# EasyEDA Pro project LIN Interceptor Board EasyEDA Pro.epro

# Schematic LIN Custom Board Final
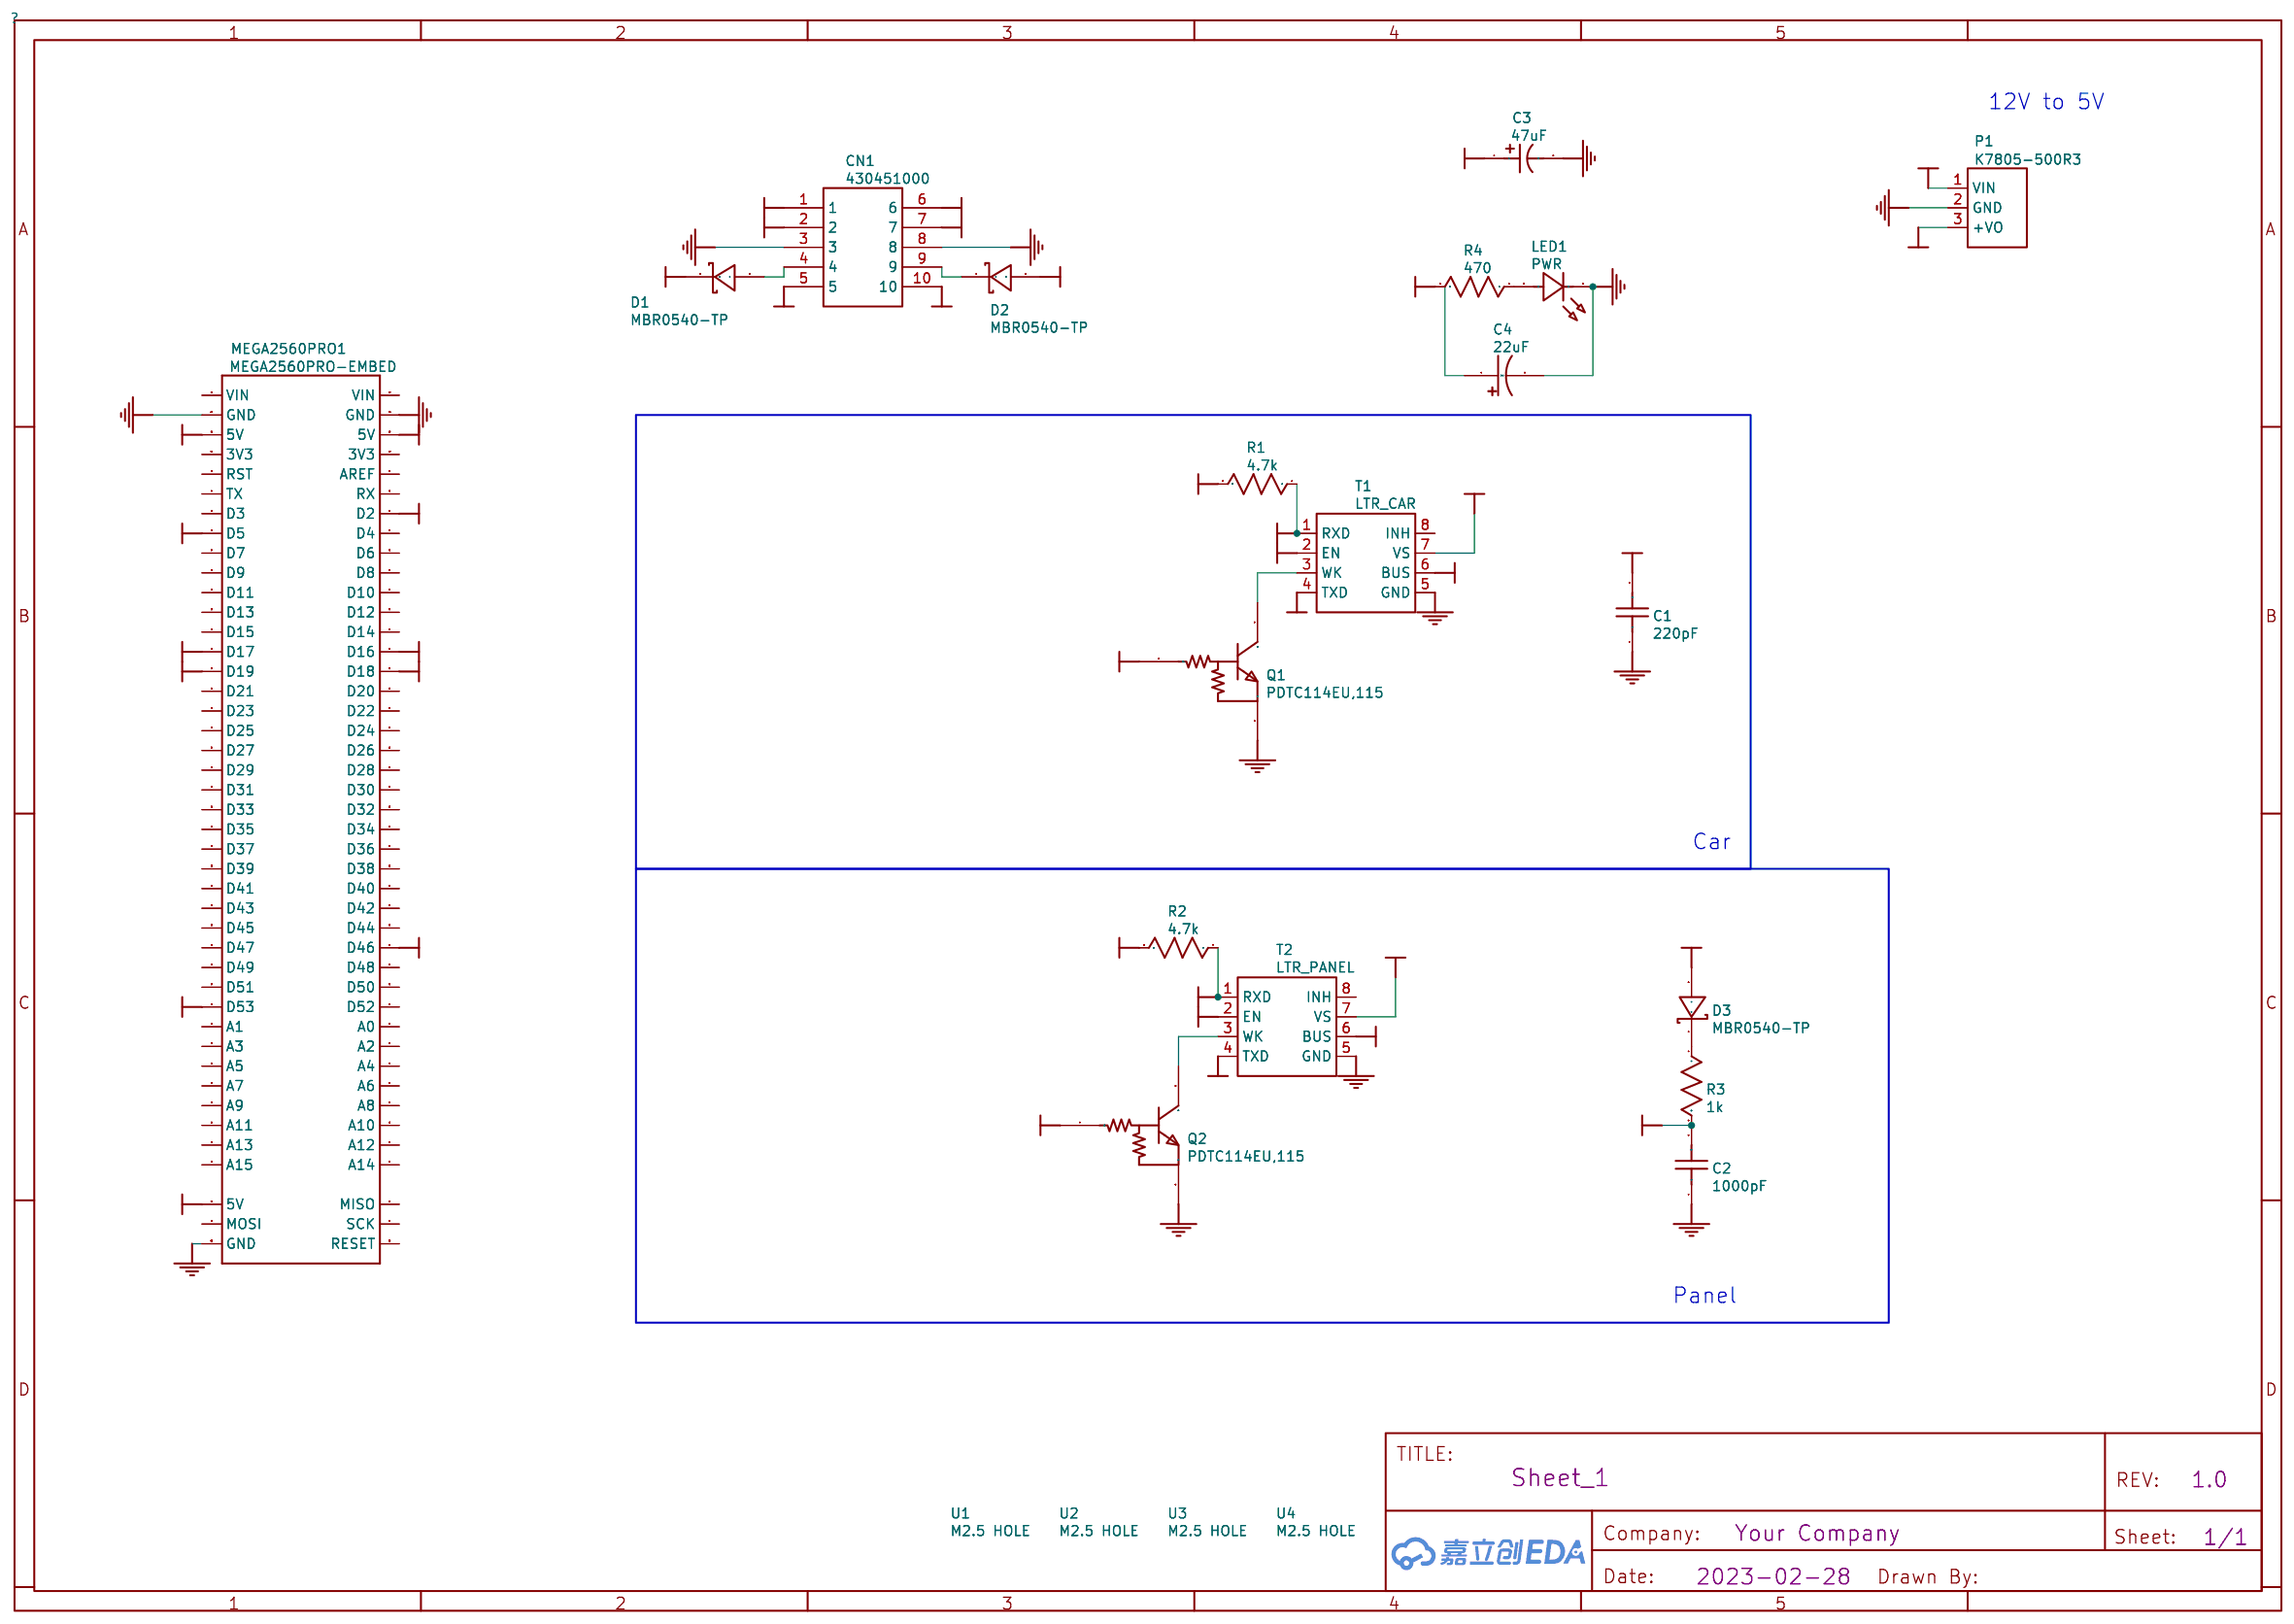
[diagram p0: schematic sheet]

## Parts
C1  220pF  [C0603]
C2  1000pF  [C0603]
C3  47uF  [CAP-SMD_BD6.3-L6.6-W6.6-LS7.3-FD]
C4  22uF  [CAP-SMD_BD4.0-L4.3-W4.3-LS5.3-FD]
CN1  430451000  [CONN-TH_43045-1000]
D1  MBR0540-TP  [SOD-123_L2.7-W1.6-LS3.7-RD]
D2  MBR0540-TP  [SOD-123_L2.7-W1.6-LS3.7-RD]
D3  MBR0540-TP  [SOD-123_L2.7-W1.6-LS3.7-RD]
LED1  PWR  [LED0603-RD_RED]
MEGA2560PRO1  MEGA2560PRO-EMBED  [MEGA2560PRO-EMBED]
P1  K7805-500R3  [PWRM-TH_K78XX-500R3]
Q1  PDTC114EU,115  [SOT-323-3_L2.0-W1.3-P1.30-LS2.1-BR]
Q2  PDTC114EU,115  [SOT-323-3_L2.0-W1.3-P1.30-LS2.1-BR]
R1  4.7k  [R0603]
R2  4.7k  [R0603]
R3  1k  [R0603]
R4  470  [R0603]
T1  LTR_CAR  [PG-DSO-8_L5.0-W4.0-P1.27-LS6.0-BL]
T2  LTR_PANEL  [PG-DSO-8_L5.0-W4.0-P1.27-LS6.0-BL]
U1  M2.5 HOLE  [HOLE_2.5MM_SCREW]
U2  M2.5 HOLE  [HOLE_2.5MM_SCREW]
U3  M2.5 HOLE  [HOLE_2.5MM_SCREW]
U4  M2.5 HOLE  [HOLE_2.5MM_SCREW]

## Library data of the parts
C1 = 220pF: nameAlias: Value(F); Contributor: LCEDA_Lib; spicePre: C; spiceSymbolName: C_0603_US
C2 = 1000pF: nameAlias: Value(F); Contributor: LCEDA_Lib; spicePre: C; spiceSymbolName: C_0603_US
C3 = 47uF: Supplier: LCSC; Supplier Part: C2992613; Manufacturer: KNSCHA(科尼盛); Manufacturer Part: XT47UF50V90RV0082; JLCPCB Part Class: Extended Part; nameAlias: Capacitance; Contributor: lcsc; spicePre: C; spiceSymbolName: XT47UF50V90RV0082
C4 = 22uF: Supplier: LCSC; Supplier Part: C335975; Manufacturer: ROQANG(容强); Manufacturer Part: RVT1A220M0405; JLCPCB Part Class: Extended Part; nameAlias: Value; Contributor: LCSC; spicePre: C; spiceSymbolName: RVT1A220M0405_C335975
CN1 = 430451000: Supplier: LCSC; Manufacturer: MOLEX; Supplier Part: C122421; JLCPCB Part Class: Extended Part; link: https://lcsc.com/eda_search?q=C122421&%26type=1&ref=editor; spicePre: C; spiceSymbolName: 0430451000
D1-D3 = MBR0540-TP: Supplier: LCSC; Supplier Part: C78744; Manufacturer: MCC(美微科); JLCPCB Part Class: Extended Part; Contributor: LCSC; spicePre: D
LED1 = PWR: Supplier: LCSC; Supplier Part: C2962776; Manufacturer: PARALIGHT(光鼎); Manufacturer Part: L-C191MJRCT; JLCPCB Part Class: Extended Part; Contributor: lcsc; spicePre: L; spiceSymbolName: L-C191MJRCT
MEGA2560PRO1 = MEGA2560PRO-EMBED: Contributor: Norseni; spicePre: M
P1 = K7805-500R3: Supplier: LCSC; Manufacturer: MORNSUN(金升阳); Supplier Part: C86735; JLCPCB Part Class: Extended Part; spicePre: U
Q1 Q2 = PDTC114EU,115: Supplier: LCSC; Manufacturer: Nexperia(安世); Supplier Part: C135830; JLCPCB Part Class: Extended Part; spicePre: Q
R1 R2 = 4.7k: nameAlias: Value(Ω); Contributor: LCEDA_Lib; spicePre: R; spiceSymbolName: R_0603_US
R3 = 1k: nameAlias: Value(Ω); Contributor: LCEDA_Lib; spicePre: R; spiceSymbolName: R_0603_US
R4 = 470: nameAlias: Value(Ω); Contributor: LCEDA_Lib; spicePre: R; spiceSymbolName: R_0603_US
T1 = LTR_CAR: Supplier: LCSC; Supplier Part: C540020; Manufacturer: Infineon(英飞凌); Manufacturer Part: TLE7259-3GE; JLCPCB Part Class: Extended Part; Contributor: LCSC; spicePre: U; spiceSymbolName: TLE7259-3GE
T2 = LTR_PANEL: Supplier: LCSC; Supplier Part: C540020; Manufacturer: Infineon(英飞凌); Manufacturer Part: TLE7259-3GE; JLCPCB Part Class: Extended Part; Contributor: LCSC; spicePre: U; spiceSymbolName: TLE7259-3GE
U1-U4 = M2.5 HOLE: Contributor: dwalker; spicePre: U

## Nets
+5V: MEGA2560PRO1.5V@1(5V) MEGA2560PRO1.5V@2(5V) MEGA2560PRO1.5V@3(5V) P1.3(+VO) R1.2 R2.2 R4.2
+12V: C3.1 D1.1(K) D2.2(A) D3.2(A) P1.1(VIN) T1.7(VS) T2.7(VS)
GND: C1.1 C2.1 C3.2 C4.2 CN1.3 CN1.8 LED1.1(K) MEGA2560PRO1.GND@1(GND) MEGA2560PRO1.GND@2(GND) MEGA2560PRO1.GND@3(GND) P1.2(GND) Q1.2(E) Q2.2(E) T1.5(GND) T2.5(GND)
+ILLUM: CN1.5 CN1.10
-ILLUM: CN1.2 CN1.7
EN1: MEGA2560PRO1.D53 T1.2(EN)
EN2: MEGA2560PRO1.D46 T2.2(EN)
LIN_CAR: C1.2 CN1.1 T1.6(BUS)
LIN_PANEL: C2.2 CN1.6 R3.2 T2.6(BUS)
RX1: MEGA2560PRO1.D19 R1.1 T1.1(RXD)
RX2: MEGA2560PRO1.D17 R2.1 T2.1(RXD)
TX1: MEGA2560PRO1.D18 T1.4(TXD)
TX2: MEGA2560PRO1.D16 T2.4(TXD)
WK1: MEGA2560PRO1.D5 Q1.1(B)
WK2: MEGA2560PRO1.D2 Q2.1(B)
CN1_9: CN1.9 D2.1(K)
D1_2: CN1.4 D1.2(A)
D3_1: D3.1(K) R3.1
Q2_3: Q2.3(C) T2.3(WK)
R4_1: LED1.2(A) R4.1
T1_3: Q1.3(C) T1.3(WK)

Not connected (* = marked no-connect by the designer): C4 1; MEGA2560PRO1 3V3@1(3V3) 3V3@2(3V3) A0 A1 A2 A3 A4 A5 A6 A7 A8 A9 A10 A11 A12 A13 A14 A15 AREF D3 D4 D6 D7 D8 D9 D10 D11 D12 D13 D14 D15 D20 D21 D22 D23 D24 D25 D26 D27 D28 D29 D30 D31 D32 D33 D34 D35 D36 D37 D38 D39 D40 D41 D42 D43 D44 D45 D47 D48 D49 D50 D51 D52 MISO MOSI RESET RST RX SCK TX VIN@1(VIN) VIN@2(VIN); T1 8(INH); T2 8(INH)

## Notes on the sheet
- 12V to 5V
- Car
- Panel

# Board 1-PCB_PCB_LIN Custom Board 6
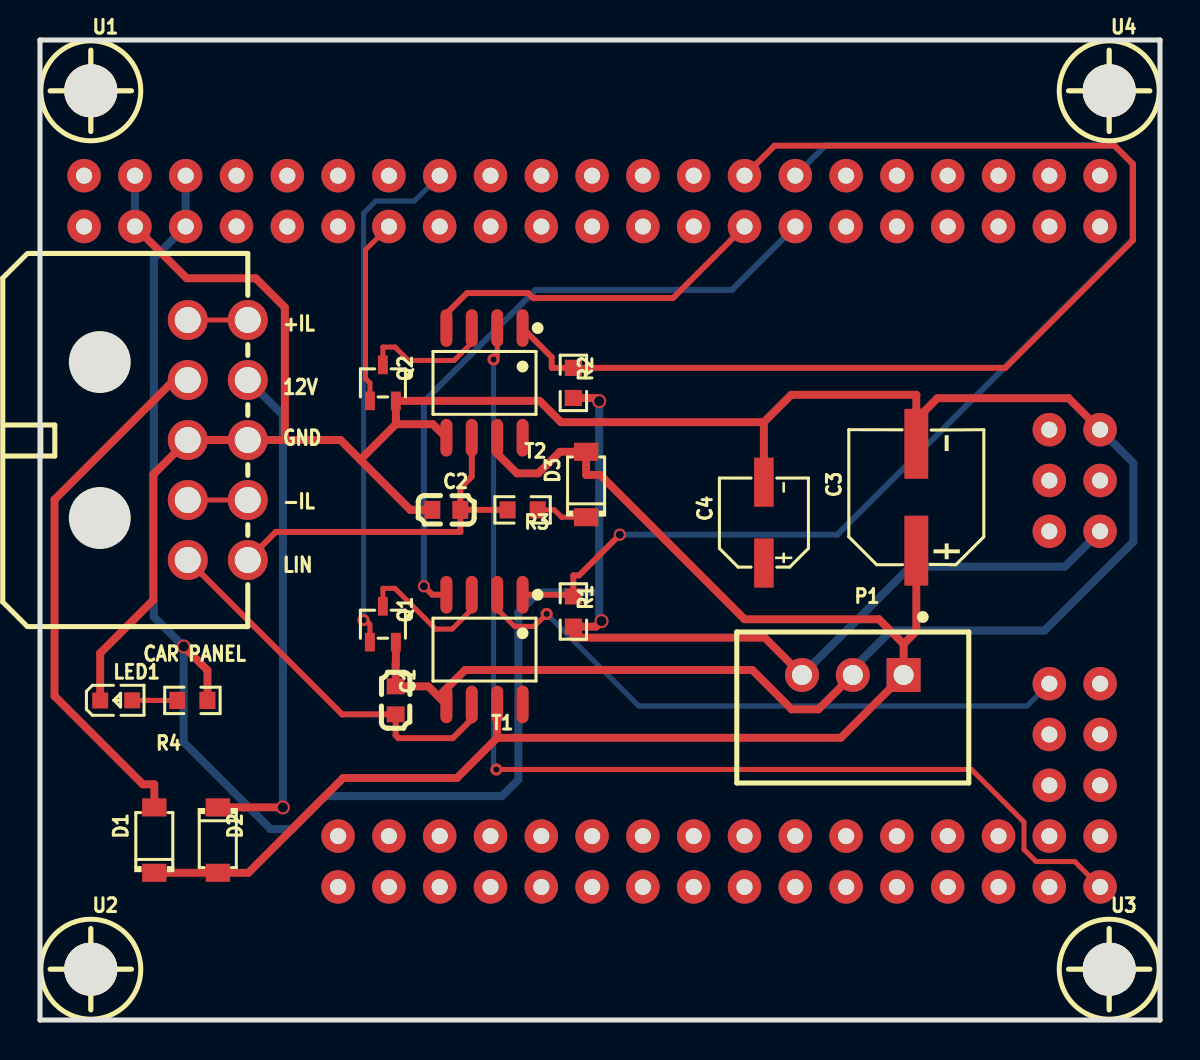
[diagram p1: board, top side]
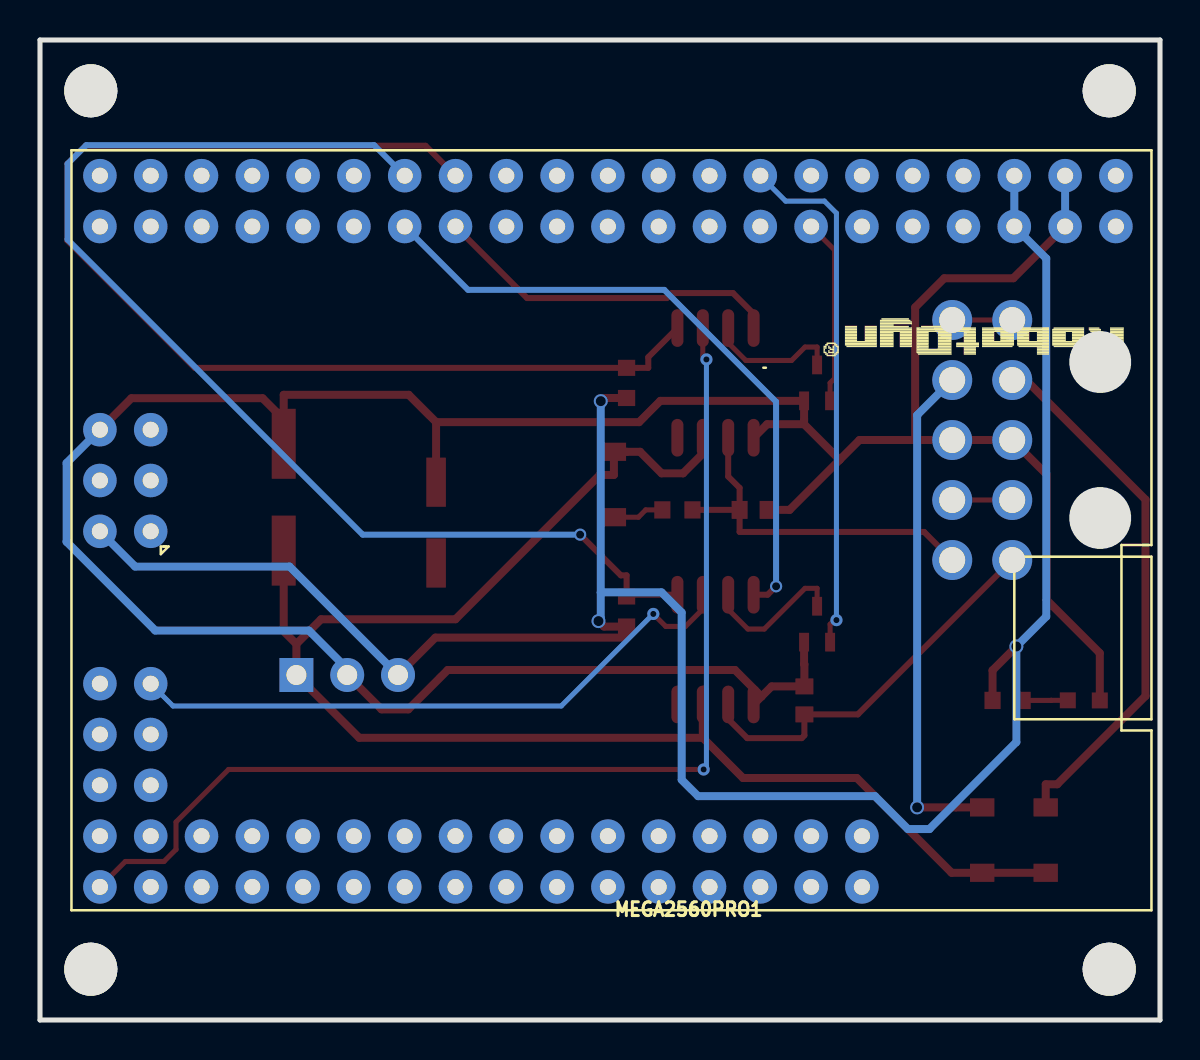
[diagram p2: board, bottom side, seen from below]

Outline 56 x 49 mm; copper layers: Top Layer, Bottom Layer. Coordinates in mm from the lower left corner of the outline.
Outline path: 0,49 56,49 56,0 0,0 0,49

## Design rules (mm)
via Default (default): diameter min 0.61, default 0.61, max 100.025; hole min 0.305, default 0.305, max 59.995
via Digital: diameter min 0.61, default 0.61, max 100.025; hole min 0.4, default 0.4, max 59.995
via Power: diameter min 0.7, default 0.7, max 100.025; hole min 0.5, default 0.5, max 59.995
net RX1 uses Digital
net TX1 uses Digital
net LIN_CAR uses Digital
net LIN_PANEL uses Digital
net RX2 uses Digital
net TX2 uses Digital
net +12V uses Power
net +5V uses Power
net CN1_9 uses Power
net GND uses Power
net D1_2 uses Power

## Placement (name value [footprint] x y rotation side)
C1  220pF  [C0603]  17.78 15.98 270 top
C2  1000pF  [C0603]  20.32 25.5 0 top
C3  47uF  [CAP-SMD_BD6.3-L6.6-W6.6-LS7.3-FD]  43.81 26.14 90 top
C4  22uF  [CAP-SMD_BD4.0-L4.3-W4.3-LS5.3-FD]  36.19 24.87 90 top
CN1  430451000  [CONN-TH_43045-1000]  8.89 29 270 top
D1  MBR0540-TP  [SOD-123_L2.7-W1.6-LS3.7-RD]  5.72 9 90 top
D2  MBR0540-TP  [SOD-123_L2.7-W1.6-LS3.7-RD]  8.89 9 270 top
D3  MBR0540-TP  [SOD-123_L2.7-W1.6-LS3.7-RD]  27.31 26.78 90 top
LED1  PWR  [LED0603-RD_RED]  3.81 15.98 0 top
MEGA2560PRO1  -  [MEGA2560PRO-EMBED]  35.22 23.17 0 bottom
P1  K7805-500R3  [PWRM-TH_K78XX-500R3]  40.64 17.25 0 top
Q1  PDTC114EU,115  [SOT-323-3_L2.0-W1.3-P1.30-LS2.1-BR]  17.15 19.79 270 top
Q2  PDTC114EU,115  [SOT-323-3_L2.0-W1.3-P1.30-LS2.1-BR]  17.15 31.86 270 top
R1  4.7k  [R0603]  26.67 20.42 270 top
R2  4.7k  [R0603]  26.67 31.86 270 top
R3  1k  [R0603]  24.13 25.5 180 top
R4  470  [R0603]  7.62 15.98 0 top
T1  LTR_CAR  [PG-DSO-8_L5.0-W4.0-P1.27-LS6.0-BL]  22.22 18.52 180 top
T2  LTR_PANEL  [PG-DSO-8_L5.0-W4.0-P1.27-LS6.0-BL]  22.22 31.86 180 top
U1  M2.5 HOLE  [HOLE_2.5MM_SCREW]  2.54 46.46 0 top
U2  M2.5 HOLE  [HOLE_2.5MM_SCREW]  2.54 2.54 0 top
U3  M2.5 HOLE  [HOLE_2.5MM_SCREW]  53.46 2.54 0 top
U4  M2.5 HOLE  [HOLE_2.5MM_SCREW]  53.46 46.46 0 top

## Footprints (pads in the part's own frame, mm; a bottom-side part is the same pattern mirrored in y, then rotated)
C0603
  rect 0.8x0.9 smd: 1(-0.7,0) 2(0.7,0)
CAP-SMD_BD4.0-L4.3-W4.3-LS5.3-FD
  rect 2.46x0.98 smd: 1(-2.02,0) 2(2.02,0)
CAP-SMD_BD6.3-L6.6-W6.6-LS7.3-FD
  rect 3.5x1.2 smd: 1(-2.67,0) 2(2.67,0)
CONN-TH_43045-1000
  round 2 hole 1.3: 1(6.001,-1.5) 2(3.001,-1.5) 3(0.002,-1.5) 4(-2.998,-1.5) 5(-5.998,-1.5) 6(6.001,1.5) 7(3.001,1.5) 8(0.002,1.5) 9(-2.998,1.5) 10(-6.001,1.5)
HOLE_2.5MM_SCREW
  round 2.65 hole 2.65: 1(0,0)
LED0603-RD_RED
  rect 0.8x0.8 smd: 1(-0.799,-0.004) 2(0.799,0.004)
MEGA2560PRO-EMBED
  round 1.677 hole 0.805x0.8: 3V3@1(-25.4,-19.05) 3V3@2(-25.4,-16.51) 5V@1(-27.94,-19.05) 5V@2(-27.94,-16.51) 5V@3(17.78,-1.27) A0(-20.32,16.51) A1(-20.32,13.97) A2(-17.78,16.51) A3(-17.78,13.97) A4(-15.24,16.51) A5(-15.24,13.97) A6(-12.7,16.51) A7(-12.7,13.97) A8(-10.16,16.51) A9(-10.16,13.97) A10(-7.62,16.51) A11(-7.62,13.97) A12(-5.08,16.51) A13(-5.08,13.97) A14(-2.54,16.51) A15(-2.54,13.97) AREF(-22.86,-16.51) D2(-17.78,-16.51) D3(-17.78,-19.05) D4(-15.24,-16.51) D5(-15.24,-19.05) D6(-12.7,-16.51) D7(-12.7,-19.05) D8(-10.16,-16.51) D9(-10.16,-19.05) D10(-7.62,-16.51) D11(-7.62,-19.05) D12(-5.08,-16.51) D13(-5.08,-19.05) D14(-2.54,-16.51) D15(-2.54,-19.05) D16(0,-16.51) D17(0,-19.05) D18(2.54,-16.51) D19(2.54,-19.05) D20(5.08,-16.51) D21(5.08,-19.05) D22(7.62,-16.51) D23(7.62,-19.05) D24(10.16,-16.51) D25(10.16,-19.05) D26(12.7,-16.51) D27(12.7,-19.05) D28(15.24,-16.51) D29(15.24,-19.05) D30(17.78,-16.51) D31(17.78,-19.05) D32(0,16.51) D33(0,13.97) D34(2.54,16.51) D35(2.54,13.97) D36(5.08,16.51) D37(5.08,13.97) D38(7.62,16.51) D39(7.62,13.97) D40(10.16,16.51) D41(10.16,13.97) D42(12.7,16.51) D43(12.7,13.97) D44(15.24,16.51) D45(15.24,13.97) D46(17.78,16.51) D47(17.78,13.97) D48(17.78,11.43) D49(15.24,11.43) D50(17.78,8.89) D51(15.24,8.89) D52(17.78,6.35) D53(15.24,6.35) GND@1(-30.48,-19.05) GND@2(-30.48,-16.51) GND@3(17.78,-6.35) MISO(15.24,-1.27) MOSI(17.78,-3.81) RESET(15.24,-6.35) RST(-22.86,-19.05) RX(-20.32,-16.51) SCK(15.24,-3.81) TX(-20.32,-19.05) VIN@1(-33.02,-19.05) VIN@2(-33.02,-16.51)
PG-DSO-8_L5.0-W4.0-P1.27-LS6.0-BL
  oval 0.602x1.885 smd: 1(-1.905,-2.743) 2(-0.634,-2.743) 3(0.635,-2.743) 4(1.905,-2.743) 5(1.905,2.742) 6(0.635,2.742) 7(-0.634,2.742) 8(-1.905,2.742)
PWRM-TH_K78XX-500R3
  rect 1.7x1.7 hole 1: 1(2.54,0)
  round 1.7 hole 1: 2(0,0) 3(-2.54,0)
R0603
  rect 0.806x0.864 smd: 1(-0.753,0) 2(0.753,0)
SOD-123_L2.7-W1.6-LS3.7-RD
  rect 0.91x1.22 smd: 1(-1.635,0) 2(1.635,0)
SOT-323-3_L2.0-W1.3-P1.30-LS2.1-BR
  rect 0.936x0.5 smd: 1(0.898,-0.65) 2(0.898,0.65) 3(-0.898,0)

## Nets
As in the schematic.

Pads without a net: U1 1; U2 1; U3 1; U4 1

## Via types
v1: diameter 0.61, hole 0.305, Top Layer to Bottom Layer, 4 vias
v2: diameter 0.7, hole 0.5, Top Layer to Bottom Layer, 4 vias
v3: diameter 0.61, hole 0.4, Top Layer to Bottom Layer, 2 vias

## Routing (per net, layer and track width the routed paths; a pad name or vN(x,y) marks a point on that pad's centre or on a via; arc(x,y) is an arc through that point)
+5V: length 109.7
  Top Layer w0.4: v2(28.08,19.95) 27.8,19.67 R1.2 26.67,19.12 36.23,19.12 P1.3 ; R2.2 27.8,31.1 v2(27.96,30.94) ; 8.37,15.98 8.37,17.48 v2(7.18,18.68)
  Bottom Layer w0.4: MEGA2560PRO1.5V@3 51.24,22.67 43.52,22.67 P1.3 ; 27.96,21.38 24.92,21.38 23.92,20.38 23.92,12.01 23.1,11.19 14.25,11.19 12.61,9.55 11.53,9.55 7.18,13.89 v2(7.18,18.68) 5.69,20.17 5.69,38.08 MEGA2560PRO1.5V@2 MEGA2560PRO1.5V@1 ; 27.96,21.38 27.96,20.06 v2(28.08,19.95) ; 27.96,21.38 v2(27.96,30.94)
+12V: length 76.3
  Top Layer w0.4: 43.18,18.8 P1.1 40.04,14.11 22.86,14.11 ; 43.18,18.8 41.94,20.04 35.22,20.04 28.01,27.25 27.31,27.25 D3.2 25.99,28.41 24.92,27.33 23.85,27.33 22.86,28.32 T2.7 ; 43.18,18.8 43.81,19.44 C3.1 ; 22.86,14.11 T1.7 ; 22.86,14.11 20.85,12.1 15.16,12.1 10.42,7.36 D2.2 D1.1
GND: length 147.3
  Top Layer w0.4: MEGA2560PRO1.GND@3 51.43,31.09 44.87,31.09 43.81,30.04 ; 17.79,29.79 19.64,29.79 T2.5 ; 17.79,29.79 16.02,28.01 ; 17.79,29.79 17.79,30.96 24.98,30.96 26.05,29.89 36.19,29.89 ; C2.1 18.52,25.5 16.02,28.01 ; 16.02,28.01 15.03,29 12.24,29 ; Q1.2 17.79,17.8 17.78,17.78 C1.1 19.42,16.68 19.92,16.17 ; 12.24,29 12.24,35.63 10.78,37.09 7.33,37.09 MEGA2560PRO1.GND@2 ; 12.24,29 7.39,29 5.67,27.28 5.67,21 3.01,18.34 LED1.1 ; 36.19,29.89 C4.2 ; 36.19,29.89 37.56,31.26 43.81,31.26 43.81,30.04 ; P1.2 38.92,15.53 37.58,15.53 35.61,17.5 21.25,17.5 19.92,16.17 ; C3.2 43.81,30.04 ; 19.92,16.17 T1.5
  Bottom Layer w0.4: P1.2 40.64,17.56 42.55,19.47 50.23,19.47 54.67,23.91 54.67,27.85 MEGA2560PRO1.GND@3 ; MEGA2560PRO1.GND@2 MEGA2560PRO1.GND@1
+ILLUM: length 3
  Top Layer w0.254: CN1.5 7.39,35 CN1.10
-ILLUM: length 3
  Top Layer w0.254: CN1.7 CN1.2
CN1_9: length 25.3
  Top Layer w0.4: v2(12.14,10.63) D2.1
  Bottom Layer w0.4: CN1.9 12.14,30.24 v2(12.14,10.63)
D1_2: length 26.9
  Top Layer w0.4: CN1.4 6.7,32 0.73,26.02 0.73,16.2 5.14,11.79 5.72,11.79 D1.2
D3_1: length 2.6
  Top Layer w0.254: 24.88,25.5 25.71,25.5 26.08,25.14 D3.1
EN1: length 31.3
  Top Layer w0.254: T1.2 22.86,20.55 23.73,19.68 24.71,19.68 v1(25.33,20.3)
  Bottom Layer w0.254: MEGA2560PRO1.D53 49.35,15.7 29.94,15.7 v1(25.33,20.3)
EN2: length 55.6
  Top Layer w0.254: v1(22.82,12.53) 46.57,12.53 49.2,9.9 49.2,8.53 49.8,7.92 51.74,7.92 MEGA2560PRO1.D46 ; v1(22.68,33.03) 22.86,33.21 T2.2
  Bottom Layer w0.254: v1(22.68,33.03) 22.68,12.67 v1(22.82,12.53)
LIN_CAR: length 19.6
  Top Layer w0.3: T1.6 21.59,15.05 20.64,14.09 17.92,14.09 17.78,14.23 C1.2 15.11,15.28 CN1.1
LIN_PANEL: length 18.5
  Top Layer w0.3: T2.6 21.59,27.18 21.02,26.61 C2.2 ; CN1.6 11.79,24.4 21.02,24.4 C2.2 ; R3.2 C2.2
Q2_3: length 6.7
  Top Layer w0.254: Q2.3 17.15,33.65 17.75,33.65 18.42,32.98 20.71,32.98 21.59,33.86 T2.3
R4_1: length 2.3
  Top Layer w0.254: LED1.2 5.44,15.98 5.44,15.98 6.87,15.98
RX1: length 60.2
  Top Layer w0.3: T1.1 26.59,21.26 R1.1 26.67,22.23 26.96,22.23 v3(28.99,24.27)
  Bottom Layer w0.3: MEGA2560PRO1.D19 39.29,43.74 53.69,43.74 54.62,42.81 54.62,39.02 39.87,24.27 v3(28.99,24.27)
RX2: length 58.5
  Top Layer w0.3: MEGA2560PRO1.D17 36.72,43.71 53.73,43.71 54.65,42.79 54.65,38.99 48.27,32.61 R2.1 25.59,32.61 25.59,33.14 T2.1
T1_3: length 7.3
  Top Layer w0.254: Q1.3 17.15,21.58 17.75,21.58 19.78,19.55 20.61,19.55 21.59,20.53 T1.3
TX1: length 32.7
  Top Layer w0.3: T1.4 19.62,21.26 v3(19.2,21.69)
  Bottom Layer w0.3: MEGA2560PRO1.D18 34.6,36.51 24.79,36.51 19.2,30.91 v3(19.2,21.69)
TX2: length 17.6
  Top Layer w0.3: T2.4 20.32,35.32 21.35,36.35 24.41,36.35 24.66,36.1 31.65,36.1 MEGA2560PRO1.D16
WK1: length 26.2
  Top Layer w0.254: Q1.1 16.5,19.79 16.29,20 v1(16.18,20)
  Bottom Layer w0.254: v1(16.18,20) 16.18,40.34 16.78,40.94 18.72,40.94 MEGA2560PRO1.D5
WK2: length 9.3
  Top Layer w0.254: MEGA2560PRO1.D2 16.27,38.5 16.27,32.08 16.5,31.85 16.5,30.96

## Text on the board
Top Silkscreen Layer: CAR PANEL | +IL | 12V | GND | -IL | LIN
